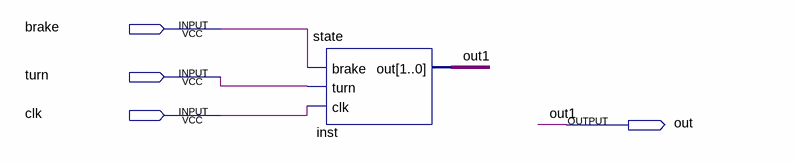
[diagram p0: schematic sheet]
// Quartus schematic test1.bdf as structural Verilog: 1 symbols, 4 pins
module test1 (
  input  brake,
  input  turn,
  input  clk,
  output out
);

  state inst (.brake(brake), .turn(turn), .clk(clk), .out(out));

  // Other names for the same wires on the sheet: out1 = out
endmodule
